# EAGLE design mic4606_power (EAGLE 6.4)
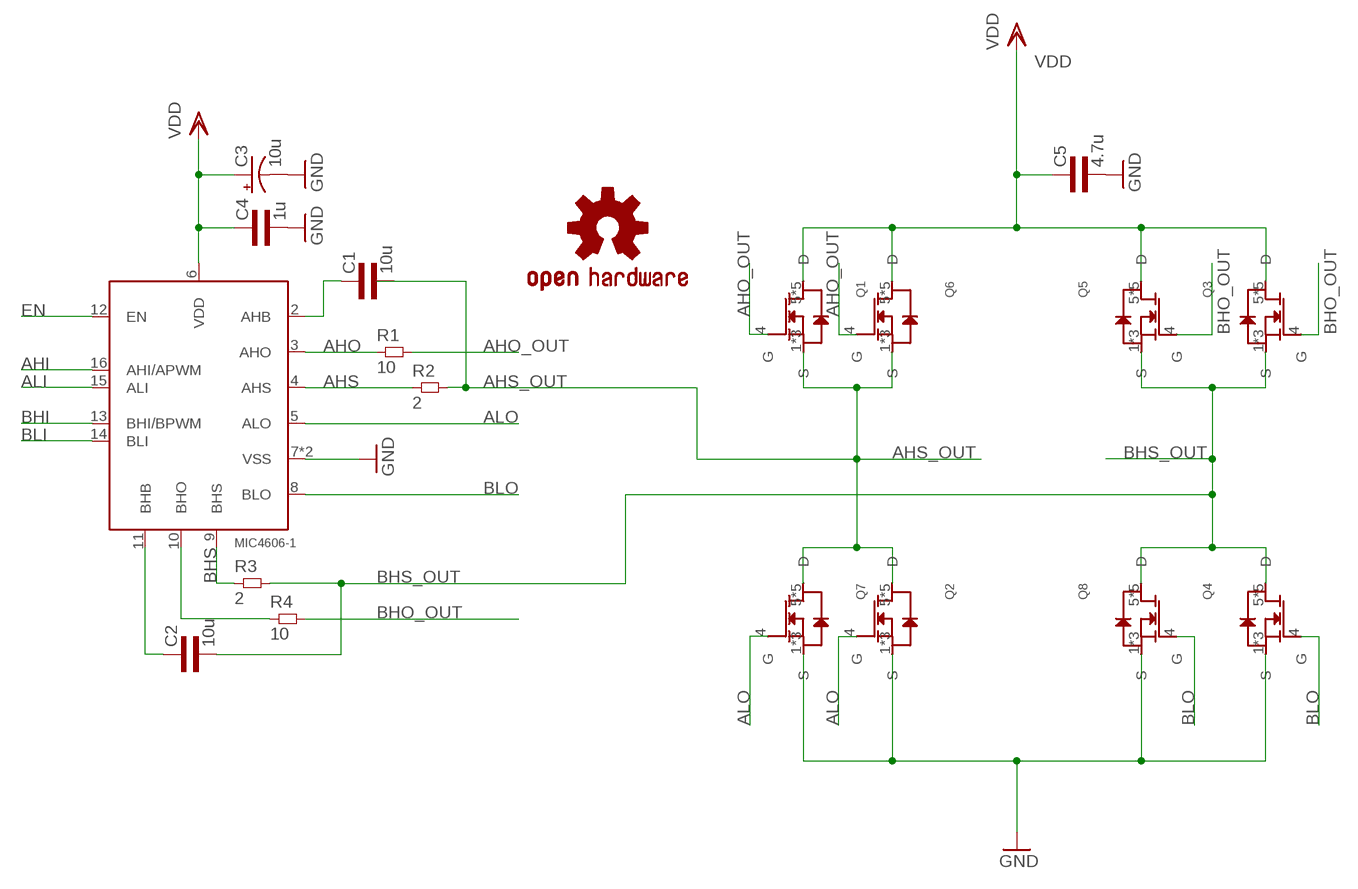
[diagram p0: schematic, sheet 1]

## Parts
C1  10u  CAP0805L3  [0805L3]
C2  10u  CAP0805L3  [0805L3]
C3  10u  CPOL-USE1.8-4  [E1,8-4]
C4  1u  CAP0603L3  [0603L3]
C5  4.7u  CAP0805L3  [0805L3]
LOGO1  OSHW-LOGOM  [OSHW-LOGO-M]
MD1  MIC4606-1  [QFN44-16LD-PL-2]
Q1  CSD18540Q5B  [Q5B]
Q2  CSD18540Q5B  [Q5B]
Q3  CSD18540Q5B  [Q5B]
Q4  CSD18540Q5B  [Q5B]
Q5  CSD18540Q5B  [Q5B]
Q6  CSD18540Q5B  [Q5B]
Q7  CSD18540Q5B  [Q5B]
Q8  CSD18540Q5B  [Q5B]
R1  10  RES0805L3  [0805L3]
R2  2  RES0805L3  [0805L3]
R3  2  RES0805L3  [0805L3]
R4  10  RES0805L3  [0805L3]

## Nets
AHI: MD1.16(AHI/APWM)
AHO: MD1.3(AHO) R1.1
AHO_OUT: Q1.4(G) Q6.4(G) R1.2
AHS: MD1.4(AHS) R2.1
AHS_OUT: C1.2 Q1.1(S) Q1.2(S) Q1.3(S) Q2.5(D) Q2.6(D) Q2.7(D) Q2.8(D) Q2.9(D) Q6.1(S) Q6.2(S) Q6.3(S) Q7.5(D) Q7.6(D) Q7.7(D) Q7.8(D) Q7.9(D) R2.2
ALI: MD1.15(ALI)
ALO: MD1.5(ALO) Q2.4(G) Q7.4(G)
BHI: MD1.13(BHI/BPWM)
BHO: MD1.10(BHO) R4.1
BHO_OUT: Q3.4(G) Q5.4(G) R4.2
BHS: MD1.9(BHS) R3.1
BHS_OUT: C2.2 Q3.1(S) Q3.2(S) Q3.3(S) Q4.5(D) Q4.6(D) Q4.7(D) Q4.8(D) Q4.9(D) Q5.1(S) Q5.2(S) Q5.3(S) Q8.5(D) Q8.6(D) Q8.7(D) Q8.8(D) Q8.9(D) R3.2
BLI: MD1.14(BLI)
BLO: MD1.8(BLO) Q4.4(G) Q8.4(G)
EN: MD1.12(EN)
GND: C3.- C4.P$2 C5.2 MD1.7(VSS) MD1.TP(VSS) Q2.1(S) Q2.2(S) Q2.3(S) Q4.1(S) Q4.2(S) Q4.3(S) Q7.1(S) Q7.2(S) Q7.3(S) Q8.1(S) Q8.2(S) Q8.3(S)
N$1: C1.1 MD1.2(AHB)
N$9: C2.1 MD1.11(BHB)
VDD: C3.+ C4.P$1 C5.1 MD1.6(VDD) Q1.5(D) Q1.6(D) Q1.7(D) Q1.8(D) Q1.9(D) Q3.5(D) Q3.6(D) Q3.7(D) Q3.8(D) Q3.9(D) Q5.5(D) Q5.6(D) Q5.7(D) Q5.8(D) Q5.9(D) Q6.5(D) Q6.6(D) Q6.7(D) Q6.8(D) Q6.9(D)

## Library data of the parts
C1 C2 C4 C5 = common:CAP
C3 = rcl:CPOL-US: POLARIZED CAPACITOR, American symbol
LOGO1 = SparkFun-Aesthetics:OSHW-LOGO: Open Source Hardware Logo This logo indicates the piece of hardware it is found on incorporates a OSHW license and/or adheres to the definition of open source hardware found here: http://freedomdefined.org/OSHW
MD1 = common:MIC4606: 85V Full-Bridge Mosfet Driver
Q1-Q8 = common:CSD18540Q5B: N-Channel High-Power MosFET; I_MAX: 221A; PD: 195W; PULSED_DRAIN_CURRENT: 400A; VGS: +/- 20V; V_MAX: 60V
R1-R4 = common:RES

## Board
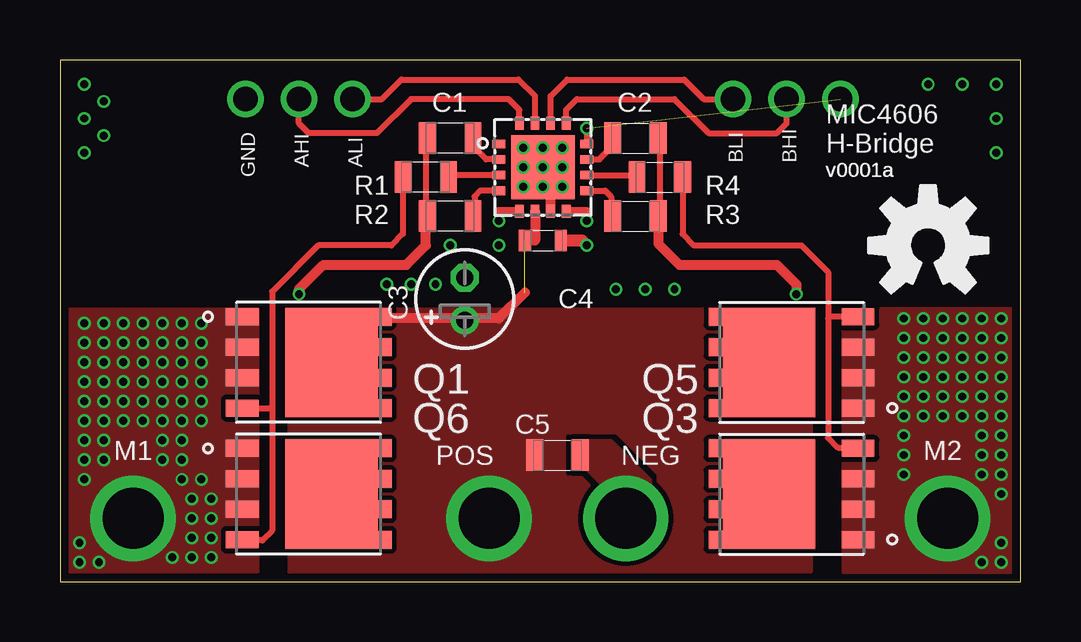
[diagram p1: board, top side]
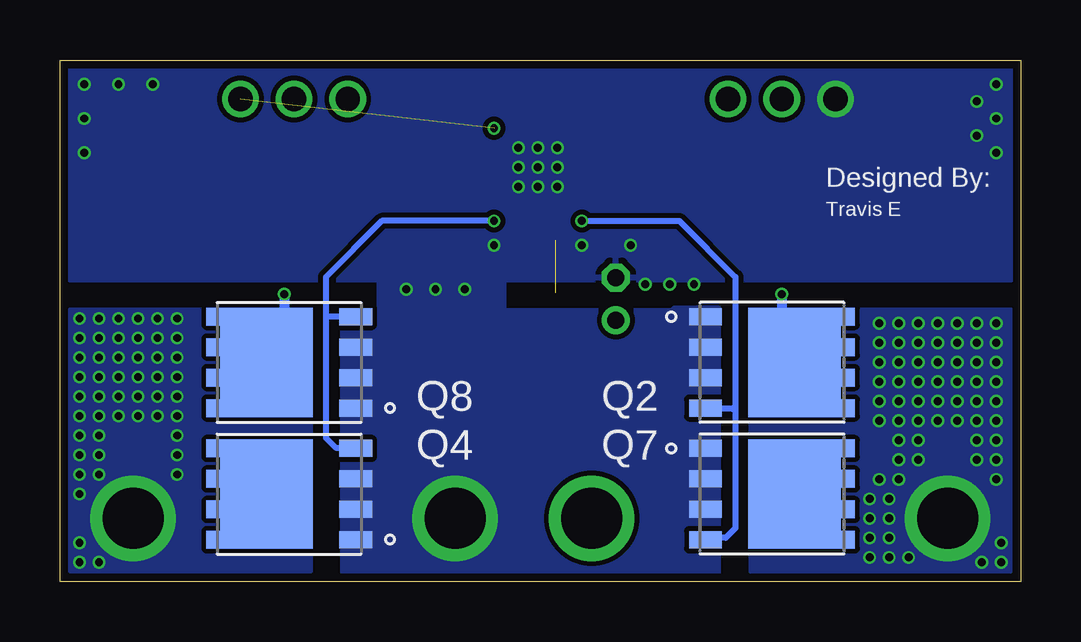
[diagram p2: board, bottom side, seen from below]

Size 40.03 x 21.74 mm. Coordinates in mm from the lower left corner, seen from the top.
Outline: 0,0 40.03,0 40.03,21.74 0,21.74 0,0
Copper layers (1*16): Top 0.035mm / dielectric 1.5mm / Bottom 0.035mm
Design rules "default *": minimum track width 8mil, minimum drill 13mil, track to track 8mil, track to pad 8mil, pad to pad 8mil, via to via 8mil, smd to smd 8mil, copper to edge 13mil, drill to drill 8mil, minimum pad ring 4mil, minimum via ring 4mil, stop-mask expansion 4mil, vias tented up to drill 13mil, thermal gap 10mil

### Footprints (pad centres in the part's own frame; a part is rotated, then mirrored left to right if it is on the bottom)
0805L3 = smd 0.7 x 1.3: 1 -0.95,0; 2 0.95,0
E1,8-4 = drill 0.711 pad 1.168: + -0.889,0 | drill 0.711 pad 1.168 octagon: - 0.889,0
0603L3 = smd 0.5 x 0.9: P$1 -0.75,0; P$2 0.75,0
QFN44-16LD-PL-2 = smd 0.53 x 0.36: 1 -1.835,0.975; 2 -1.835,0.325; 3 -1.835,-0.325; 4 -1.835,-0.975; 9 1.835,-0.975; 10 1.835,-0.325; 11 1.835,0.325; 12 1.835,0.975 | smd 0.36 x 0.53: 5 -0.975,-1.835; 6 -0.325,-1.835; 7 0.325,-1.835; 8 0.975,-1.835; 13 0.975,1.835; 14 0.325,1.835; 15 -0.325,1.835; 16 -0.975,1.835 | smd 2.65 x 2.65: TP 0,0
Q5B = smd 1.372 x 0.71: 1 2.77,-1.905; 2 2.77,-0.635; 3 2.77,0.635; 4 2.77,1.905 | smd 0.59 x 0.71: 5 -3.161,1.905; 6 -3.161,0.635; 7 -3.161,-0.635; 8 -3.161,-1.905 | smd 3.85 x 4.52: 9 -0.941,0

### Placement (x,y rotation side)
C1  16.26,18.49 180 top
C2  23.98,18.49 0 top
C3  16.87,11.79 90 top
C4  20.12,14.22 0 top
C5  20.73,5.28 0 top
LOGO1  36.17,14.02 0 top
MD1  20.12,17.27 0 top
Q1  10.36,9.14 180 top
Q2  10.36,9.14 180 bottom
Q3  30.48,3.66 0 top
Q4  30.48,3.66 0 bottom
Q5  30.48,9.14 0 top
Q6  10.36,3.66 180 top
Q7  10.36,3.66 180 bottom
Q8  30.48,9.14 0 bottom
R1  15.24,16.87 180 top
R2  16.26,15.24 180 top
R3  23.98,15.24 0 top
R4  24.99,16.87 0 top

### Tracks (layer width: path | path; a pad name or v marks a point on that pad's centre or on a via)
AHI  (via drill 1.02)
  Top 0.254: MD1.16 19.14,19.67 18.69,20.12 14.63,20.12 13.21,18.69 10.36,18.69 9.96,19.1 v9.96,20.12
AHO
  Top 0.254: MD1.3 16.27,16.95 R1.1
AHO_OUT
  Top 0.254: R1.2 14.29,14.49 13.82,14.02 10.77,14.02 8.84,12.09 8.84,7.32 | 8.84,7.32 8.84,2.13 8.43,1.73 7.62,1.73 Q6.4 | Q1.4 8.76,7.24 8.84,7.32
AHS
  Top 0.254: MD1.4 17.52,16.3 17.27,16.05 17.27,15.31 R2.1
AHS_OUT  (via drill 0.33, 2.54)
  Top 0.254: C1.2 15.31,17.95 15.24,17.88 15.24,15.85 15.31,15.78 R2.2
  Top 0.406: v9.96,11.99 9.96,12.19 10.97,13.21 14.43,13.21 15.24,14.02 15.24,15.17 R2.2
  Bottom 0.406: v9.96,11.99 9.96,9.68 Q2.9
  other vias: 3.05,2.64 1.02,10.77 1.83,10.77 2.64,10.77 3.45,10.77 4.27,10.77 5.08,10.77 5.89,10.77 1.02,9.96 1.83,9.96 2.64,9.96 3.45,9.96 4.27,9.96 5.08,9.96 5.89,9.96 1.02,9.14 1.83,9.14 2.64,9.14 3.45,9.14 4.27,9.14 5.08,9.14 5.89,9.14 1.02,8.33 1.83,8.33 2.64,8.33 3.45,8.33 4.27,8.33 5.08,8.33 5.89,8.33 1.02,7.52 1.02,6.71 1.02,5.89 1.02,5.08 1.02,4.27 1.83,7.52 1.83,6.71 1.83,5.89 1.83,5.08 2.64,7.52 2.64,6.71 3.45,7.52 3.45,6.71 4.27,7.52 4.27,6.71 5.08,7.52 5.08,6.71 5.89,7.52 5.89,6.71 4.27,5.89 4.27,5.08 5.08,5.89 5.08,5.08 5.08,4.27 5.89,4.27 5.49,3.45 5.49,2.64 5.49,1.83 5.49,1.02 6.3,3.45 6.3,2.64 6.3,1.83 6.3,1.02 4.67,1.02 0.81,0.81 0.81,1.63 1.63,0.81
  pour Top (no thermals): 8.23,11.38 8.23,0.41 0.41,0.41 0.41,11.38
  pour Bottom (no thermals): 11.28,11.38 0.41,11.38 0.41,0.41 11.28,0.41
ALI  (via drill 1.02)
  Top 0.254: v12.19,20.12 13.41,20.12 14.22,20.93 19.1,20.93 19.79,20.24 MD1.15
ALO  (via drill 0.33)
  Top 0.356: MD1.5 18.29,15.44 v18.29,15.04
  Bottom 0.254: v18.29,15.04 14.22,15.04 11.89,12.7 11.89,7.11 | 11.89,7.11 11.89,2.24 12.29,1.83 13.06,1.83 Q7.4 | Q2.4 12.01,7.24 11.89,7.11
BHI  (via drill 1.02)
  Top 0.254: MD1.13 21.09,19.67 21.54,20.12 25.6,20.12 27.03,18.69 29.87,18.69 30.28,19.1 v30.28,20.12
BHO
  Top 0.254: MD1.10 23.96,16.95 R4.1
BHO_OUT
  Top 0.254: R4.2 25.94,14.49 26.42,14.02 30.89,14.02 32,12.9 32,10.97 | 32,10.97 32,5.99 32.41,5.59 33.23,5.59 Q3.4 | Q5.4 32.08,11.05 32,10.97
BHS
  Top 0.254: MD1.9 22.72,16.3 22.96,16.05 22.96,15.31 R3.1
BHS_OUT  (via drill 0.33, 2.54)
  Top 0.254: C2.2 24.93,17.95 24.99,17.88 24.99,15.85 24.93,15.78 R3.2
  Top 0.406: R3.2 24.93,14.09 25.81,13.21 29.87,13.21 30.68,12.4 v30.68,11.99
  Bottom 0.406: v30.68,11.99 30.68,9.88 Q8.9
  other vias: 36.98,2.64 39.22,10.97 38.4,10.97 37.59,10.97 36.78,10.97 35.97,10.97 35.15,10.97 35.15,10.16 35.15,9.35 35.15,8.53 35.15,7.72 35.15,6.91 35.15,6.1 35.15,5.28 35.15,4.47 35.97,10.16 36.78,10.16 37.59,10.16 38.4,10.16 39.22,10.16 35.97,9.35 36.78,9.35 37.59,9.35 38.4,9.35 39.22,9.35 35.97,8.53 36.78,8.53 37.59,8.53 38.4,8.53 39.22,8.53 35.97,7.72 35.97,6.91 36.78,7.72 36.78,6.91 37.59,7.72 37.59,6.91 38.4,7.72 38.4,6.91 39.22,7.72 39.22,6.91 38.4,6.1 38.4,5.28 38.4,4.47 39.22,6.1 39.22,5.28 39.22,4.47 39.22,3.66 39.22,0.81 39.22,1.63 38.4,0.81
  pour Top (no thermals): 32.61,11.38 32.61,0.41 39.62,0.41 39.62,11.38
  pour Bottom (no thermals): 29.57,11.38 29.57,0.41 39.62,0.41 39.62,11.38
BLI  (via drill 1.02)
  Top 0.254: MD1.14 20.44,20.24 21.13,20.93 26.01,20.93 26.82,20.12 v28.04,20.12
BLO  (via drill 0.33)
  Top 0.356: MD1.8 21.95,15.44 v21.95,15.04
  Bottom 0.254: v21.95,15.04 26.62,15.04 28.96,12.7 28.96,10.97 | 28.96,10.97 28.96,5.99 28.55,5.59 27.73,5.59 Q4.4 | Q8.4 28.88,11.05 28.96,10.97
EN  (via drill 0.33, 1.02)  (1 unrouted)
  Top 0.254: v21.95,18.9 MD1.12
  other vias: 32.51,20.12
GND  (via drill 0.33, 1.02, 2.54)
  Top 0.254: 20.44,16.95 MD1.TP
  Top 0.406: MD1.7 20.44,16.95
  Top 0.508: C4.P$2 21.74,14.22 v21.95,14.02
  other vias: 23.57,2.64 19.3,18.08 20.12,18.08 20.93,18.08 19.3,17.27 20.12,17.27 20.93,17.27 19.3,16.46 20.12,16.46 20.93,16.46 13.61,12.4 14.63,12.4 15.65,12.4 1.02,20.73 1.02,19.3 1.02,17.88 39.01,20.73 37.59,20.73 36.17,20.73 39.01,19.3 39.01,17.88 16.26,14.02 18.29,14.02 23.16,12.19 24.38,12.19 25.6,12.19 7.72,20.12 1.83,18.59 1.83,20.02
  pour Top (no thermals): 21.34,5.89 22.96,5.89 24.59,4.27 24.59,1.42 24.38,1.22 22.76,1.22 22.56,1.42 22.56,4.06 21.95,4.67 21.34,4.67
  pour Bottom (no thermals): 12.6,11.38 14.43,11.38 14.53,11.28 26.31,11.28 26.42,11.38 28.24,11.38 28.24,0.41 12.6,0.41
  pour Bottom: 0.41,21.34 39.62,21.34 39.62,12.6 26.72,12.6 26.72,0.51 21.54,0.51 21.54,12.6 0.41,12.6
N$1
  Top 0.254: MD1.2 17.76,17.6 17.27,18.08 17.27,18.43 C1.1
N$9
  Top 0.254: MD1.11 22.47,17.6 23.16,18.29 23.16,18.35 C2.1
VDD  (via drill 2.54)  (1 unrouted)
  Top 0.406: MD1.6 19.79,14.22 C4.P$1 | 19.37,12.05 18.29,10.97 13.6,10.97 Q1.8
  other vias: 17.88,2.64
  pour Top (rank 2, no thermals): 9.55,11.38 31.29,11.38 31.29,0.41 9.55,0.41

### Text on the board
tPlace: MIC4606 | H-Bridge | GND | AHI | ALI | BLI | BHI | v0001a | v0001a | v0001a | M1 | POS | NEG | M2
bPlace: Designed By: | Travis E